# Altium schematic sheet PowerSupply.SchDoc
size A4
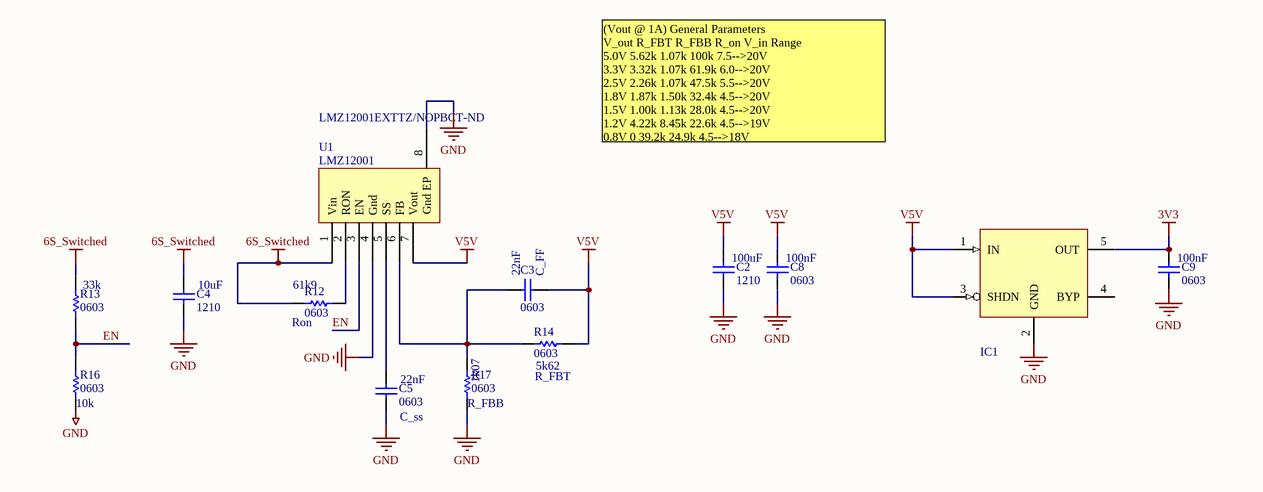
[diagram p0: PowerSupply.SchDoc]

## Parts
C2  value 100uF  package: 1210  [1210_M]  (hidden comment: C)
C3  value 22nF  package: 0603  [0603_M]  (hidden comment: C)
C4  value 10uF  package: 1210  [1210_M]  (hidden comment: C)
C5  value 22nF  package: 0603  [0603_M]  (hidden comment: C)
C8  value 100nF  package: 0603  [0603_M]  (hidden comment: C)
C9  value 100nF  package: 0603  [0603_M]  (hidden comment: C)
IC1  3.3V Regulator  [SOT23-5]  (value not drawn)
R12  value 61k9  package: 0603  [0603_M]  (hidden comment: R)
R13  value 33k  package: 0603  [0603_M]  (hidden comment: R)
R14  value 5k62  package: 0603  [0603_M]  (hidden comment: R)
R16  value 10k  package: 0603  [0603_M]  (hidden comment: R)
R17  value 1k07  package: 0603  [0603_M]  (hidden comment: R)
U1  LMZ12001  Supplier Part Number 1: LMZ12001EXTTZ/NOPBCT-ND  [LMZ12001]

## Nets
3V3: C9.1 IC1.5(OUT)
6S_Switched: C4.1 R12.2 R13.2 U1.1(Vin)
GND: C2.2 C4.2 C5.2 C8.2 C9.2 IC1.2(GND) R16.1 R17.1 U1.4(Gnd) U1.8(Gnd_EP)
V5V: C2.1 C3.2 C8.1 IC1.1(IN) IC1.3(SHDN) R14.2 U1.7(Vout)
EN: R13.1 R16.2 U1.3(EN)
NetC3_1: C3.1 R14.1 R17.2 U1.6(FB)
NetC5_1: C5.1 U1.5(SS)
NetR12_1: R12.1 U1.2(RON)

Not connected (* = marked no-connect by the designer): IC1 4(BYP)

## Notes on the sheet
- (Vout @ 1A) General Parameters
  V_out	R_FBT	R_FBB	R_on	V_in Range
  5.0V	5.62k	1.07k	100k	7.5-->20V
  3.3V	3.32k	1.07k	61.9k	6.0-->20V
  2.5V	2.26k	1.07k	47.5k	5.5-->20V
  1.8V	1.87k	1.50k	32.4k	4.5-->20V
  1.5V	1.00k	1.13k	28.0k	4.5-->20V
  1.2V	4.22k	8.45k	22.6k	4.5-->19V
  0.8V	0	39.2k	24.9k	4.5-->18V
- (near C3) C_FF
- (near R12) Ron
- (near C5) C_ss
- (near R17) R_FBB
- (near R14) R_FBT

## Library data of the parts
C2-C5 C8 C9 = C: Default Capacitor; Supplier: Digikey
IC1 = MIC5259-3.3: Manufacturer: Micrel Inc; Manufacturer Part Number: MIC5259-3.3YD5 TR; Regulator Topology: Positive Fixed; Voltage - Input: Up to 6V; Voltage - Dropout (Typical): 0.3V @ 300mA; Number of Regulators: 1; Current - Output: 300mA; Current - Limit (Min): 350mA; Supplier 1: Digi-Key; RoHS: RoHS Compliant; Category: Integrated Circuits (ICs); Stock 1: 10613; Pricing 1: 1=1.23, 25=0.98, 100=0.735, 250=0.686, 500=0.6615 (USD); Voltage - Output: 3.3V; Operating Temperature: -40°C ~ 125°C; Mounting Type: Surface Mount; Package / Case: SOT-23-5 Thin, TSOT-23-5; Supplier Device Package: TSOT-23-5; Packaging: Cut Tape (CT); ComponentLink1URL: http://www.micrel.com/_PDF/mic5259.pdf; ComponentLink1Description: http://www.micrel.com/_PDF/mic5259.pdf; Supplier Part Number 1: 576-2833-1-ND
R12-R14 R16 R17 = R: Resistor; Supplier 1: Digikey
U1 = LMZ12001: Switching Regulator; Supplier 1: Digi-Key